# Altium schematic sheet Bass Debug Board.SchDoc
size A3; SheetNumber: 1; SheetTotal: 1
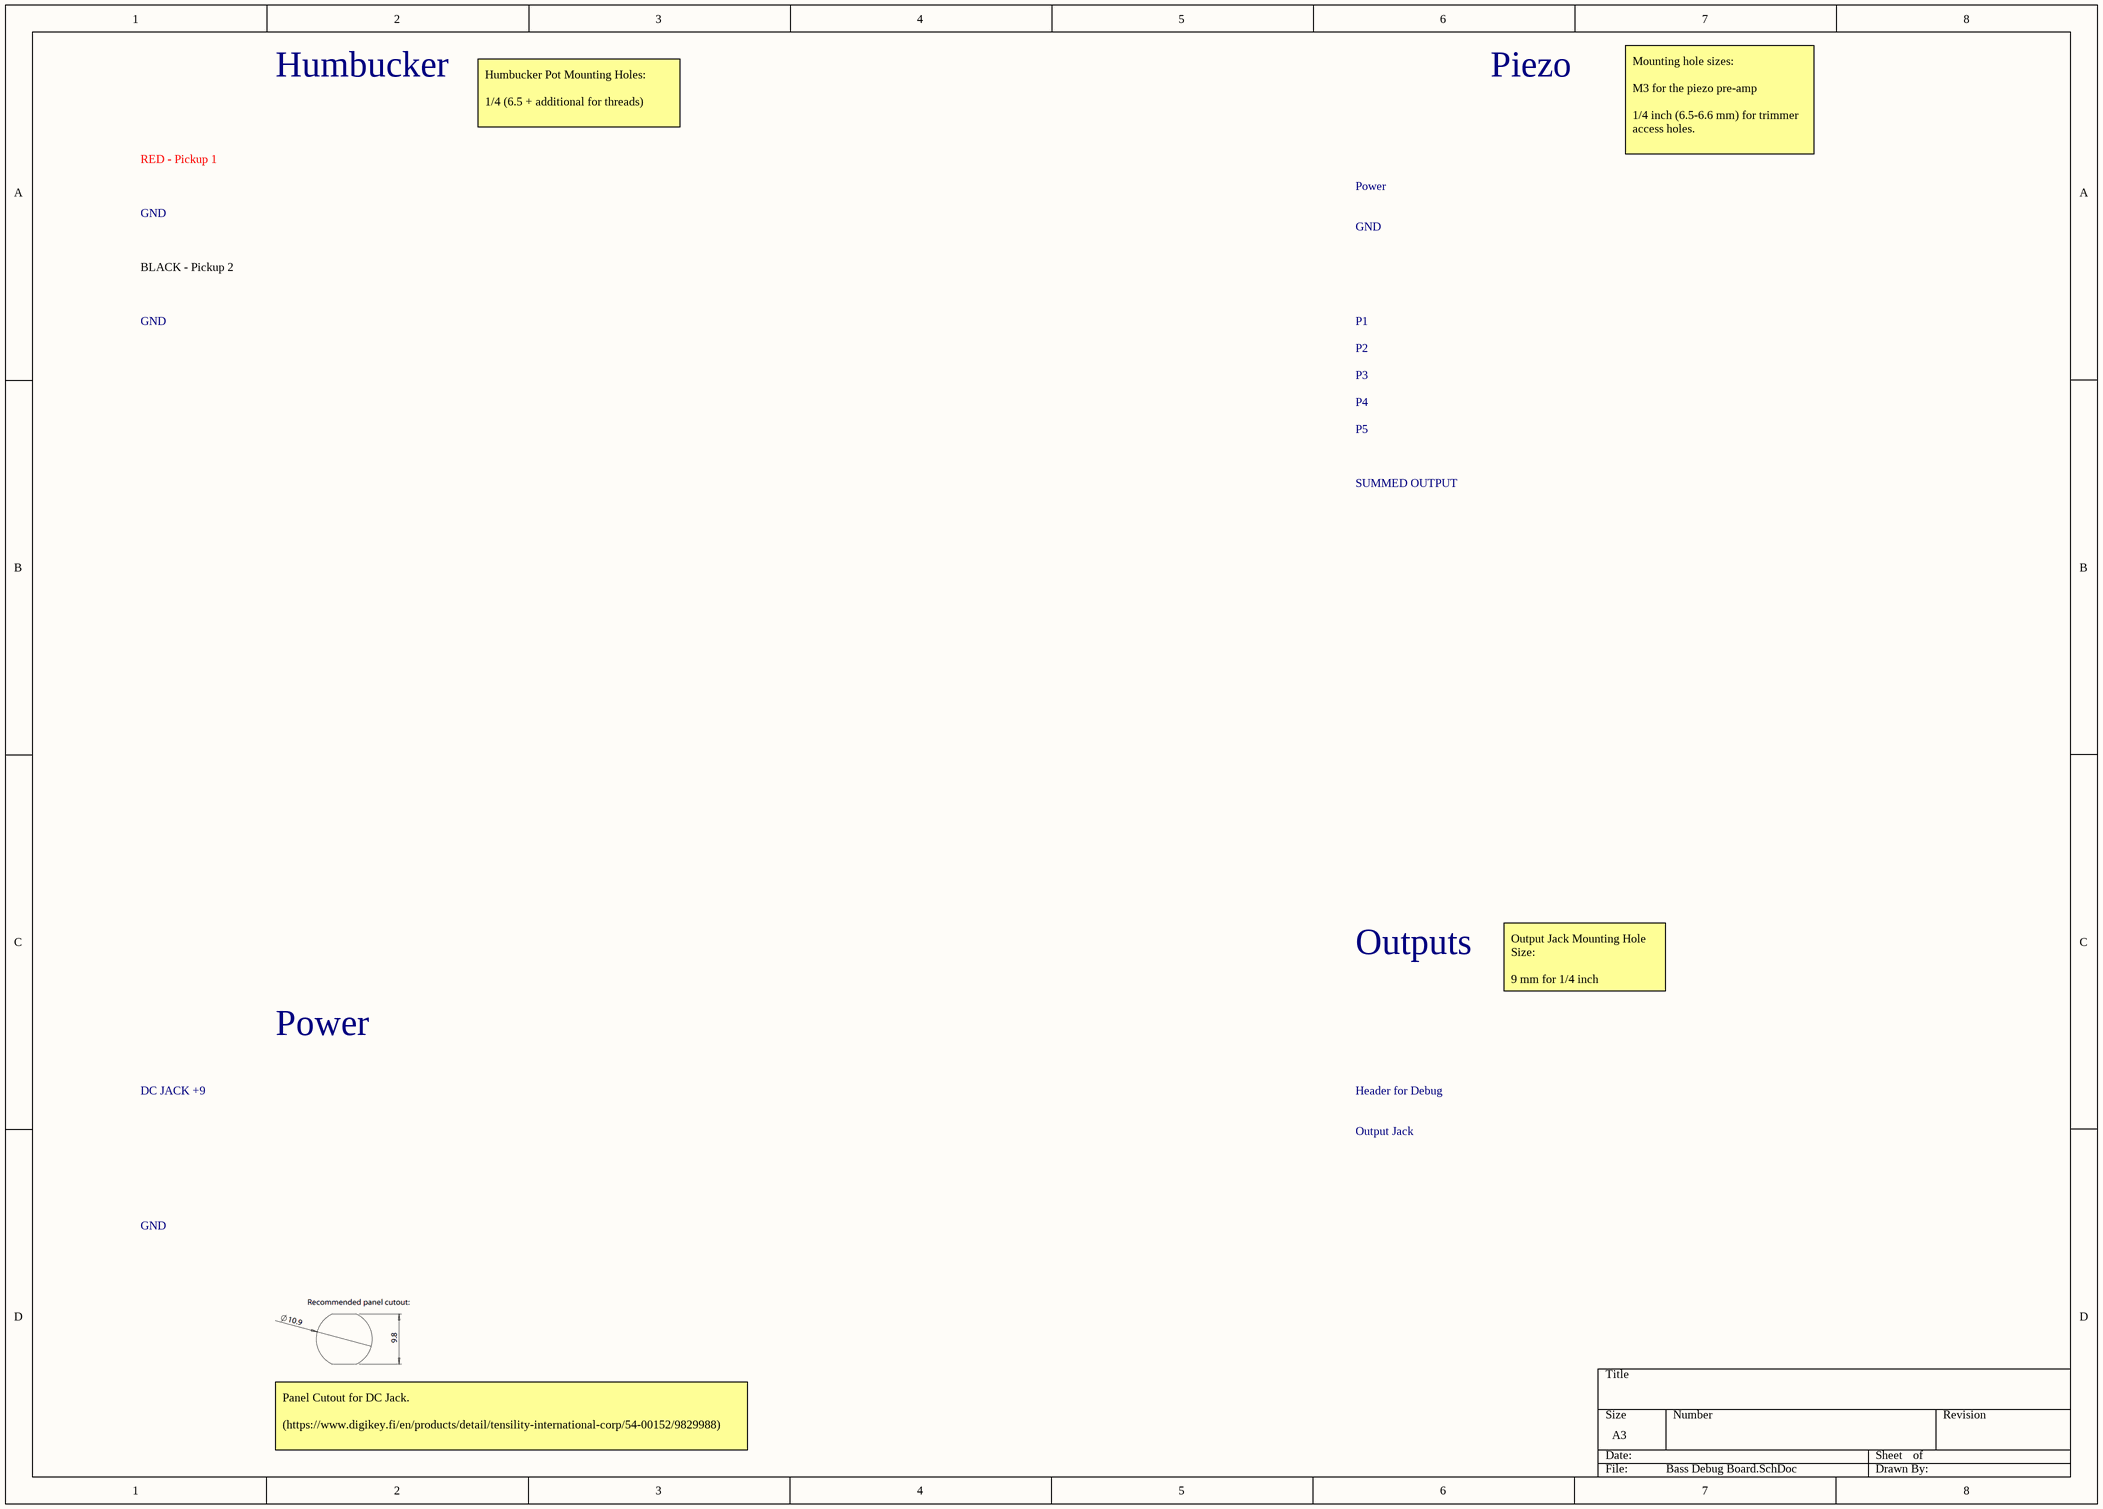
[diagram p0: Bass Debug Board.SchDoc]

## Notes on the sheet
- Humbucker
- Piezo
- RED - Pickup 1
- Humbucker Pot Mounting Holes:
  1/4 (6.5 + additional for threads)
- Mounting hole sizes:
  M3 for the piezo pre-amp
  1/4 inch (6.5-6.6 mm) for trimmer access holes.
- GND
- Power
- BLACK - Pickup 2
- P1
- P2
- P3
- P4
- P5
- SUMMED OUTPUT
- Outputs
- Output Jack Mounting Hole Size:
  9 mm for 1/4 inch
- DC JACK +9
- Header for Debug
- Output Jack
- Panel Cutout for DC Jack.
  (https://www.digikey.fi/en/products/detail/tensility-international-corp/54-00152/9829988)